# EAGLE schematic kaya-insolev1 (EAGLE 8.5.0)
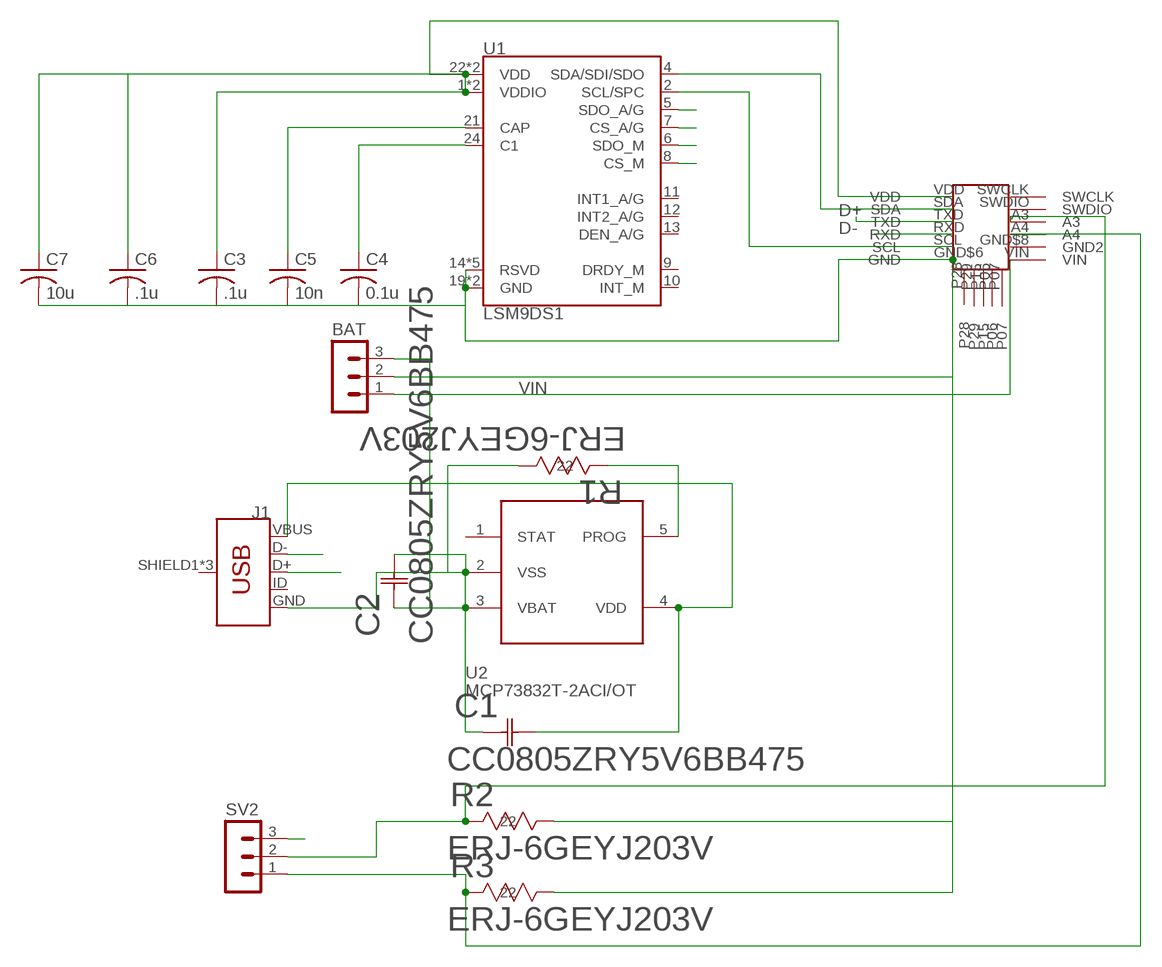
[diagram p0: schematic, sheet 1]

## Parts
BAT  MA03-1  [MA03-1]
C1  CC0805ZRY5V6BB475  [YAG_CC0805]
C2  CC0805ZRY5V6BB475  [YAG_CC0805]
C3  .1u  C-USC0603  [C0603]
C4  0.1u  C-USC0603  [C0603]
C5  10n  C-USC0603  [C0603]
C6  .1u  C-USC0603  [C0603]
C7  10u  C-USC0603  [C0603]
J1  USB_MICRO-B_FEMALE-SMT  [USB-B-MICRO-SMD]
R1  ERJ-6GEYJ203V  [RC0805N]
R2  ERJ-6GEYJ203V  [RC0805N]
R3  ERJ-6GEYJ203V  [RC0805N]
SV2  MA03-1  [MA03-1]
U1  LSM9DS1  [LGA-24-3.5X3]
U2  MCP73832T-2ACI/OT  [SOT23-5]
U$1  BLE-NANO  [BLE-NANO-PKG]

## Nets
D+: J1.D+ U$1.TXD
D-: J1.D- U$1.RXD
N$1: C1.1 C2.1 C2.2 J1.GND R1.1 U2.2(VSS)
N$2: BAT.2 C3.2 C4.2 C5.2 C6.2 C7.2 R2.1 R3.1 U1.14(RSVD) U1.15(RSVD) U1.16(RSVD) U1.17(RSVD) U1.18(RSVD) U1.19(GND) U1.20(GND) U$1.GND$6(GND)
N$3: U1.4(SDA/SDI/SDO) U$1.SDA
N$4: U1.2(SCL/SPC) U$1.SCL
N$5: C4.1 U1.24(C1)
N$6: C5.1 U1.21(CAP)
N$7: C3.1 C6.1 C7.1 U1.1(VDDIO) U1.3(VDDIO) U1.22(VDD) U1.23(VDD) U$1.VDD
N$8: C1.2 J1.VBUS U2.4(VDD)
N$9: BAT.3 U2.3(VBAT)
N$11: R1.2 U2.5(PROG)
N$13: R2.2 SV2.2 U$1.A3
N$14: R3.2 SV2.1 U$1.A4
VDD: SV2.3 U1.5(SDO_A/G) U1.6(SDO_M) U1.7(CS_A/G) U1.8(CS_M)
VIN: BAT.1 U$1.VIN
Unconnected: J1.ID J1.SHIELD1(SHIELD) J1.SHIELD2(SHIELD) J1.SHIELD3(SHIELD) U1.9(DRDY_M) U1.10(INT_M) U1.11(INT1_A/G) U1.12(INT2_A/G) U1.13(DEN_A/G) U2.1(STAT) U$1.GND$8(GND2) U$1.P06 U$1.P07 U$1.P15 U$1.P28 U$1.P29 U$1.SWCLK U$1.SWDIO

## Library data of the parts
BAT SV2 = con-lstb:MA03-1: PIN HEADER; OC_FARNELL: unknown; OC_NEWARK: unknown
C1 C2 = Yageo 4.7uF Cap:CC0805ZRY5V6BB475; MANUFACTURER_PART_NUMBER: CC0805ZRY5V6BB475; VENDOR: Yageo
C3-C7 = rcl:C-US: CAPACITOR, American symbol; SPICEPREFIX: C
J1 = SparkFun-Connectors:USB_MICRO-B: USB Type Micro-B Connector Male/female and PTH/SMT variants SparkFun Products: SparkFun microB USB Breakout <https://www.sparkfun.com/products/12035> SparkFun USB microB Plug Breakout <https://www.sparkfun.com/products/10031> SparkFun ESP8266 Thing <https://www.sparkfun.com/products/13231>; PROD_ID: CONN-11752
R1-R3 = Panasonic 20K Res:ERJ-6GEYJ203V; MANUFACTURER_PART_NUMBER: ERJ6GEYJ203V; VENDOR: Panasonic
U1 = SparkFun-Sensors:LSM9DS1: ST Microelectronics LSM9DS1 9DOF IMU - Accelerometer, Gyroscope & Magnetometer The LSM9DS1 is a versatile, motion-sensing system-in-a-chip. It houses a 3-axis accelerometer, 3-axis gyroscope, and 3-axis magnetometer – nine degrees of freedom (9DOF) in a single IC! The LSM9DS1 is equipped with a digital interface, but even that is flexible: it supports both I2C and SPI, so you’ll be hard-pressed to find a microcontroller it doesn’t work with. Datasheet <https://cdn.sparkfun.com/assets/learn_tutorials/3/7/3/LSM9DS1_Datasheet.pdf> SparkFun Products SparkFun 9 Degrees of Freedom IMU Breakout - LSM9DS1 <https://www.sparkfun.com/products/13284> (SEN-13284) SparkFun Photon IMU Shield <https://www.sparkfun.com/products/13629> (DEV-13629); PROD_ID: IC-12536
U2 = MCP73832T-2ACI_OT:MCP73832T-2ACI/OT: http://octopart.com/mcp73832t-2aci%2Fot-microchip-664172; AVAILABILITY: Unavailable; MF: Microchip; MP: MCP73832T-2ACI-OT; PACKAGE: SOT-23-5 Microchip; PRICE: None
U$1 = BLE-NANO:BLE-NANO